# EAGLE design NovaSMTPracticeVX (EAGLE 7.3.0)
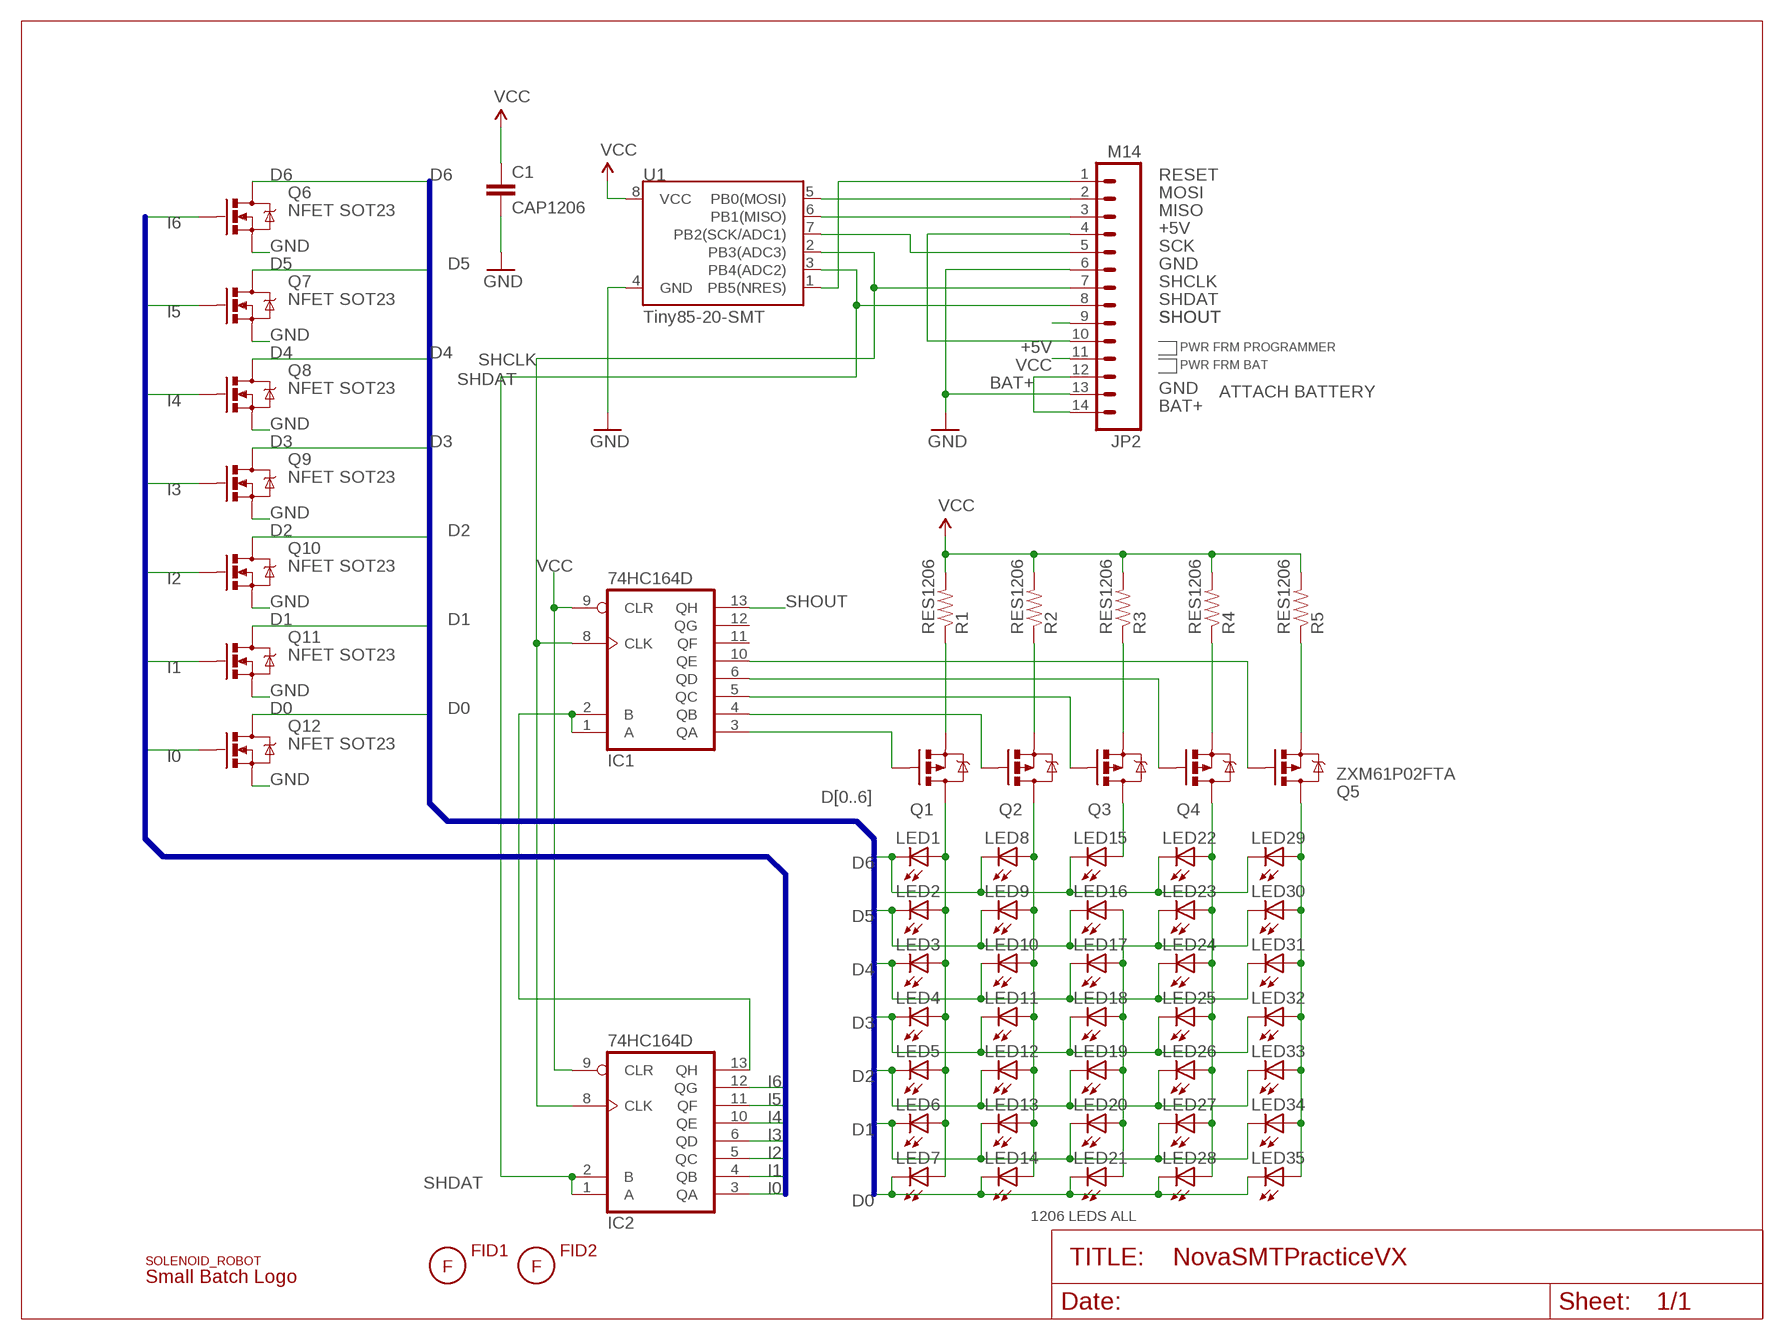
[diagram p0: schematic, sheet 1]

## Parts
C1  CAP1206  [1206]
FID1  FIDUCIAL  [FID05MM]
FID2  FIDUCIAL  [FID05MM]
IC1  74HC164D  [SO14]
IC2  74HC164D  [SO14]
JP2  M14  [1X14_SMTPADS]
LED1  LED1206  [LED-1206]
LED2  LED1206  [LED-1206]
LED3  LED1206  [LED-1206]
LED4  LED1206  [LED-1206]
LED5  LED1206  [LED-1206]
LED6  LED1206  [LED-1206]
LED7  LED1206  [LED-1206]
LED8  LED1206  [LED-1206]
LED9  LED1206  [LED-1206]
LED10  LED1206  [LED-1206]
LED11  LED1206  [LED-1206]
LED12  LED1206  [LED-1206]
LED13  LED1206  [LED-1206]
LED14  LED1206  [LED-1206]
LED15  LED1206  [LED-1206]
LED16  LED1206  [LED-1206]
LED17  LED1206  [LED-1206]
LED18  LED1206  [LED-1206]
LED19  LED1206  [LED-1206]
LED20  LED1206  [LED-1206]
LED21  LED1206  [LED-1206]
LED22  LED1206  [LED-1206]
LED23  LED1206  [LED-1206]
LED24  LED1206  [LED-1206]
LED25  LED1206  [LED-1206]
LED26  LED1206  [LED-1206]
LED27  LED1206  [LED-1206]
LED28  LED1206  [LED-1206]
LED29  LED1206  [LED-1206]
LED30  LED1206  [LED-1206]
LED31  LED1206  [LED-1206]
LED32  LED1206  [LED-1206]
LED33  LED1206  [LED-1206]
LED34  LED1206  [LED-1206]
LED35  LED1206  [LED-1206]
Q1  MOSFET-PCHANNELSMD  [SOT23-3]
Q2  MOSFET-PCHANNELSMD  [SOT23-3]
Q3  MOSFET-PCHANNELSMD  [SOT23-3]
Q4  MOSFET-PCHANNELSMD  [SOT23-3]
Q5  ZXM61P02FTA  MOSFET-PCHANNELSMD  [SOT23-3]
Q6  NFET SOT23  MOSFET-NCHANNELSMD  [SOT23-3]
Q7  NFET SOT23  MOSFET-NCHANNELSMD  [SOT23-3]
Q8  NFET SOT23  MOSFET-NCHANNELSMD  [SOT23-3]
Q9  NFET SOT23  MOSFET-NCHANNELSMD  [SOT23-3]
Q10  NFET SOT23  MOSFET-NCHANNELSMD  [SOT23-3]
Q11  NFET SOT23  MOSFET-NCHANNELSMD  [SOT23-3]
Q12  NFET SOT23  MOSFET-NCHANNELSMD  [SOT23-3]
R1  RES1206  [1206]
R2  RES1206  [1206]
R3  RES1206  [1206]
R4  RES1206  [1206]
R5  RES1206  [1206]
U1  Tiny85-20-SMT  ATTINY45TINY85-20-SMT  [SO08-EIAJ]
U$1  SOLENOID_ROBOT  [SOLENOID_ROBT_450MIL]
U$4  SMALLBATCH_LOGO750W  [SMALLBATCH_750W]

## Nets
+5V: JP2.4 JP2.10
BAT+: JP2.12 JP2.14
D0: LED7.C LED14.C LED21.C LED28.C LED35.C Q12.3(D)
D1: LED6.C LED13.C LED20.C LED27.C LED34.C Q11.3(D)
D2: LED5.C LED12.C LED19.C LED26.C LED33.C Q10.3(D)
D3: LED4.C LED11.C LED18.C LED25.C LED32.C Q9.3(D)
D4: LED3.C LED10.C LED17.C LED24.C LED31.C Q8.3(D)
D5: LED2.C LED9.C LED16.C LED23.C LED30.C Q7.3(D)
D6: LED1.C LED8.C LED15.C LED22.C LED29.C Q6.3(D)
GND: C1.2 JP2.6 JP2.13 Q6.2(S) Q7.2(S) Q8.2(S) Q9.2(S) Q10.2(S) Q11.2(S) Q12.2(S) U1.4(GND)
I0: IC2.3(QA) Q12.1(G)
I1: IC2.4(QB) Q11.1(G)
I2: IC2.5(QC) Q10.1(G)
I3: IC2.6(QD) Q9.1(G)
I4: IC2.10(QE) Q8.1(G)
I5: IC2.11(QF) Q7.1(G)
I6: IC2.12(QG) Q6.1(G)
MISO: JP2.3 U1.6(PB1(MISO))
MOSI: JP2.2 U1.5(PB0(MOSI))
N$1: IC1.1(A) IC1.2(B) IC2.13(QH)
N$8: LED1.A LED2.A LED3.A LED4.A LED5.A LED6.A LED7.A Q1.3(D)
N$9: LED8.A LED9.A LED10.A LED11.A LED12.A LED13.A LED14.A Q2.3(D)
N$10: LED16.A LED17.A LED18.A LED19.A LED20.A LED21.A
N$11: LED22.A LED23.A LED24.A LED25.A LED26.A LED27.A LED28.A Q4.3(D)
N$12: LED29.A LED30.A LED31.A LED32.A LED33.A LED34.A LED35.A Q5.3(D)
N$13: LED15.A Q3.3(D)
N$15: Q1.2(S) R1.1
N$16: Q2.2(S) R2.1
N$18: Q3.2(S) R3.1
N$19: Q4.2(S) R4.1
N$20: Q5.2(S) R5.1
N$21: IC1.3(QA) Q1.1(G)
N$22: IC1.4(QB) Q2.1(G)
N$23: IC1.5(QC) Q3.1(G)
N$24: IC1.6(QD) Q4.1(G)
N$25: IC1.10(QE) Q5.1(G)
RESET: JP2.1 U1.1(PB5(NRES))
SCK: JP2.5 U1.7(PB2(SCK/ADC1))
SHCLK: IC1.8(CLK) IC2.8(CLK) JP2.7 U1.2(PB3(ADC3))
SHDAT: IC2.1(A) IC2.2(B) JP2.8 U1.3(PB4(ADC2))
SHOUT: IC1.13(QH) JP2.9
VCC: C1.1 IC1.9(CLR) IC2.9(CLR) JP2.11 R1.2 R2.2 R3.2 R4.2 R5.2 U1.8(VCC)
Unconnected: IC1.11(QF) IC1.12(QG)

## Buses
D[0..6]
I[0..6]

## Notes on the sheet
- PWR FRM PROGRAMMER
- PWR FRM BAT
- ATTACH BATTERY
- 1206 LEDS ALL

## Power pins joined to a net without a drawn wire
GND: IC1.7(GND) IC2.7(GND)
VCC: IC1.14(VCC) IC2.14(VCC)

## Library data of the parts
C1 = NovaEagleCADCLass:CAP1206
FID1 FID2 = _cogwheel:FIDUCIAL
IC1 IC2 = 74xx-us:74*164: 8-bit parallel out SHIFT REGISTER
JP2 = NovaEagleCADCLass:M14: Header 14 Standard 14-pin 0.1" header. Use with straight break away headers (SKU : PRT-00116), right angle break away headers (PRT-00553), swiss pins (PRT-00743), machine pins (PRT-00117), and female headers (PRT-00115).
LED1-LED35 = NovaEagleCADCLass:LED: LEDs Standard schematic elements and footprints for 5mm, 3mm, 1206, and 0603 sized LEDs. 5mm - Spark Fun Electronics SKU : COM-00529 (and others)
Q1-Q5 = SparkFun-DiscreteSemi:MOSFET-PCHANNEL: Generic PMOSFET
Q6-Q12 = _cogwheel:MOSFET-NCHANNEL
R1-R5 = NovaEagleCADCLass:RES1206
U1 = NovaEagleCADCLass:ATTINY45: Atmel 8-pin 2/4/8kB flash uC; PROD_ID: IC-09092
U$1 = _cogwheel:SOLENOID_ROBOT
U$4 = _cogwheel:SMALLBATCH_LOGO

## Net classes
0 default: width 0.178 mm

## Board
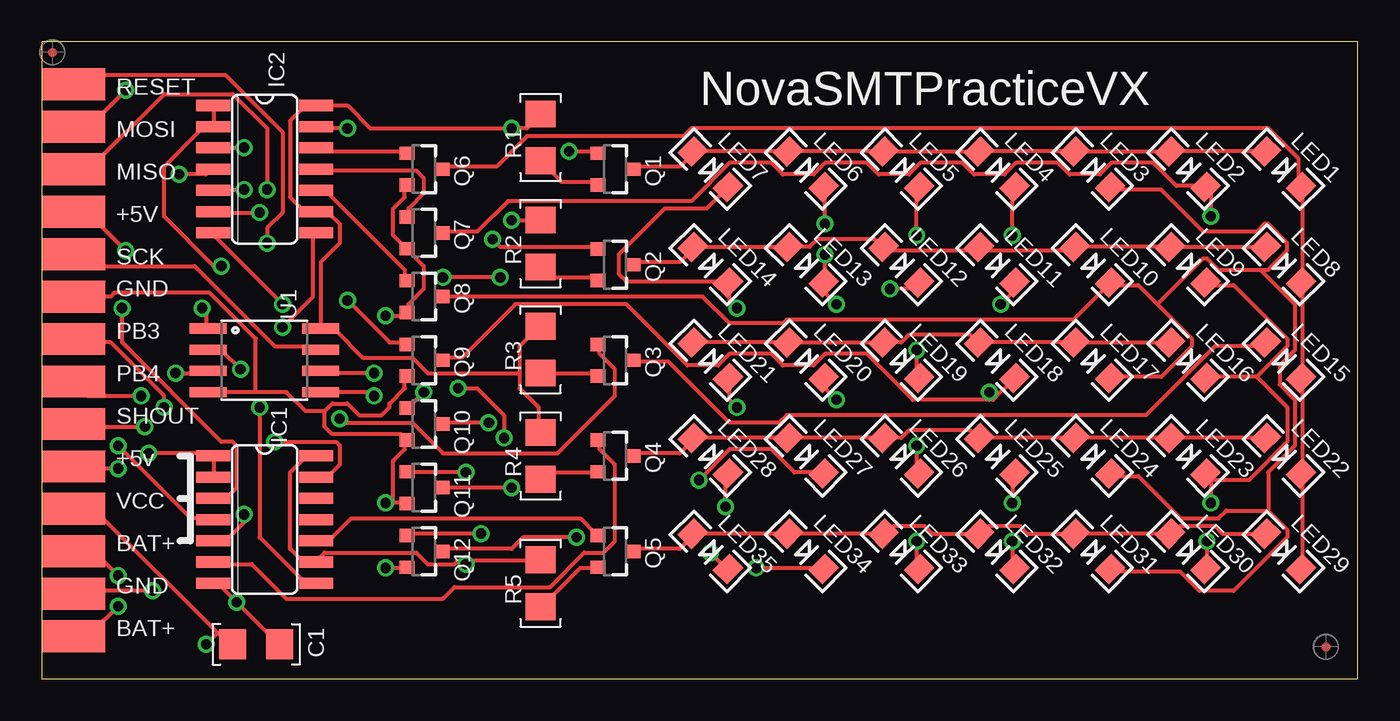
[diagram p1: board, top side]
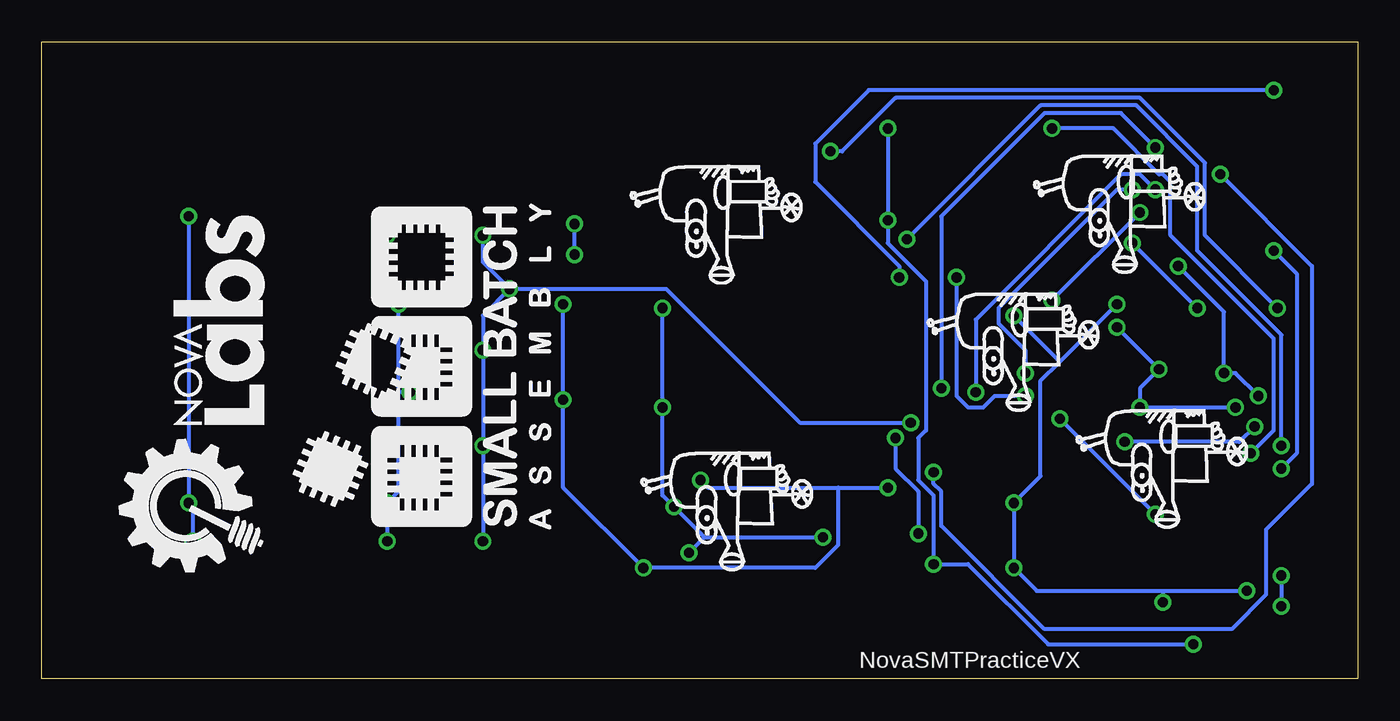
[diagram p2: board, bottom side, seen from below]

Size 78.74 x 38.1 mm. Coordinates in mm from the lower left corner, seen from the top.
Outline: 78.74,38.1 0,38.1 0,0 78.74,0 78.74,38.1
Copper layers (1*16): Top 0.035mm / dielectric 1.5mm / Bottom 0.035mm
Design rules "default *": minimum track width 10mil, minimum drill 24mil, track to track 8mil, track to pad 8mil, pad to pad 8mil, via to via 8mil, smd to smd 8mil, copper to edge 40mil, drill to drill 8mil, minimum pad ring 10mil, minimum via ring 8mil, stop-mask expansion 4mil, vias tented up to drill 27mil, thermal gap 10mil

### Footprints (pad centres in the part's own frame; a part is rotated, then mirrored left to right if it is on the bottom)
1206 = smd 1.6 x 1.8: 1 -1.4,0; 2 1.4,0
SO14 = smd 0.66 x 2.032: 1 -3.81,-3.073; 2 -2.54,-3.073; 3 -1.27,-3.073; 4 0,-3.073; 5 1.27,-3.073; 6 2.54,-3.073; 7 3.81,-3.073; 8 3.81,3.073; 9 2.54,3.073; 10 1.27,3.073; 11 0,3.073; 12 -1.27,3.073; 13 -2.54,3.073; 14 -3.81,3.073
1X14_SMTPADS = smd 1.905 x 3.81: 1 0,0; 2 2.54,0; 3 5.08,0; 4 7.62,0; 5 10.16,0; 6 12.7,0; 7 15.24,0; 8 17.78,0; 9 20.32,0; 10 22.86,0; 11 25.4,0; 12 27.94,0; 13 30.48,0; 14 33.02,0
LED-1206 = smd 1.2 x 1.4: A -1.5,0; C 1.5,0
SOT23-3 = smd 0.8 x 0.9: 1 -0.95,-1; 2 0.95,-1; 3 0,1.1
SO08-EIAJ = smd 0.61 x 2.21: 1 -1.905,-3.378; 2 -0.635,-3.378; 3 0.635,-3.378; 4 1.905,-3.378; 5 1.905,3.353; 6 0.635,3.353; 7 -0.635,3.353; 8 -1.905,3.353

### Placement (x,y rotation side)
C1  12.83,2.06 0 top
FID1  0.64,37.46 270 top
FID2  76.84,1.9 270 top
IC1  13.34,9.53 270 top
IC2  13.34,30.48 270 top
JP2  1.9,35.56 270 top
LED1  74.3,30.48 315 top
LED2  68.58,30.48 315 top
LED3  62.87,30.48 315 top
LED4  57.15,30.48 315 top
LED5  51.43,30.48 315 top
LED6  45.72,30.48 315 top
LED7  40,30.48 315 top
LED8  74.3,24.77 315 top
LED9  68.58,24.77 315 top
LED10  62.87,24.77 315 top
LED11  57.15,24.77 315 top
LED12  51.43,24.77 315 top
LED13  45.72,24.77 315 top
LED14  40,24.77 315 top
LED15  74.3,19.05 315 top
LED16  68.58,19.05 315 top
LED17  62.87,19.05 315 top
LED18  57.15,19.05 315 top
LED19  51.43,19.05 315 top
LED20  45.72,19.05 315 top
LED21  40,19.05 315 top
LED22  74.3,13.34 315 top
LED23  68.58,13.34 315 top
LED24  62.87,13.34 315 top
LED25  57.15,13.34 315 top
LED26  51.43,13.34 315 top
LED27  45.72,13.34 315 top
LED28  40,13.34 315 top
LED29  74.3,7.62 315 top
LED30  68.58,7.62 315 top
LED31  62.87,7.62 315 top
LED32  57.15,7.62 315 top
LED33  51.43,7.62 315 top
LED34  45.72,7.62 315 top
LED35  40,7.62 315 top
Q1  34.29,30.48 270 top
Q2  34.29,24.77 270 top
Q3  34.29,19.05 270 top
Q4  34.29,13.34 270 top
Q5  34.29,7.62 270 top
Q6  22.86,30.48 270 top
Q7  22.86,26.67 270 top
Q8  22.86,22.86 270 top
Q9  22.86,19.05 270 top
Q10  22.86,15.24 270 top
Q11  22.86,11.43 270 top
Q12  22.86,7.62 270 top
R1  29.84,32.38 90 top
R2  29.84,26.04 90 top
R3  29.84,19.68 90 top
R4  29.84,13.34 90 top
R5  29.84,5.71 90 top
U1  13.34,19.05 270 top
U$1  33.02,23.5 90 bottom
U$2  [NOVA-LABS-LOGO-FULL-SMALL]  65.41,6.35 90 bottom
U$3  SOLENOID_ROBOT  [SOLENOID_ROBT_450MIL]  15.24,15.88 90 bottom
U$4  48.26,8.89 90 bottom
U$5  SOLENOID_ROBOT  [SOLENOID_ROBT_450MIL]  8.89,24.13 90 bottom
U$6  SOLENOID_ROBOT  [SOLENOID_ROBT_450MIL]  6.35,8.89 90 bottom
U$7  SOLENOID_ROBOT  [SOLENOID_ROBT_450MIL]  32.38,6.35 90 bottom

### Tracks (layer width: path | path; a pad name or v marks a point on that pad's centre or on a via)
+5V  (via drill 0.61)
  Top 0.254: v4.57,12.57 2.06,12.57 JP2.10 | v5.03,25.6 2.74,27.89 2.06,27.89 JP2.4
  Bottom 0.254: v4.57,12.57 3.66,13.49 3.66,24.23 v5.03,25.6
BAT+  (via drill 0.61)
  Top 0.254: v4.57,4.34 2.97,2.74 2.06,2.74 JP2.14 | v4.57,6.17 3.2,7.54 2.06,7.54 JP2.12
  Bottom 0.254: v4.57,6.17 v4.57,4.34
D0  (via drill 0.61)
  Top 0.254: LED7.C 40.92,29.26 39.78,28.12 37.26,28.12 34.52,25.38 34.52,24.23 34.98,23.77 40.92,23.77 LED14.C 41.15,23.55 41.15,22.63 v41.6,22.17 | v32,8.46 28.8,8.46 28.12,7.77 24,7.77 Q12.3 | v40,7.54 40.92,6.63 LED35.C | v40.92,10.29 40.92,12.12 LED28.C | v41.6,16.23 41.15,16.69 41.15,17.83 LED21.C
  Bottom 0.254: 39.09,8.46 v32,8.46 | v40,7.54 39.09,8.46 | 39.09,8.46 v40.92,10.29 41.6,10.97 v41.6,16.23 v41.6,22.17
D1  (via drill 0.61)
  Top 0.254: v28.12,11.43 Q11.3 | v39.32,11.89 41.15,13.72 43.66,13.72 45.03,12.34 46.63,12.34 LED27.C | v42.75,6.63 46.63,6.63 LED34.C | v47.55,16.69 46.86,17.37 46.86,17.83 LED20.C | v47.55,22.4 46.86,23.09 46.86,23.55 LED13.C 46.86,23.77 v46.86,25.38 | v46.86,27.2 46.86,29.26 LED6.C
  Bottom 0.254: 31.09,11.43 38.86,11.43 v39.32,11.89 | 31.09,11.43 v28.12,11.43 | 31.09,11.43 31.09,8 32.46,6.63 v42.75,6.63 47.55,11.43 v47.55,16.69 v47.55,22.4 | v46.86,25.38 v46.86,27.2
D2  (via drill 0.61)
  Top 0.254: v26.75,15.32 24,15.32 Q10.3 | v50.75,23.32 52.12,23.32 52.35,23.55 LED12.C | v52.35,8.23 52.35,6.63 LED33.C | v52.35,13.95 52.35,12.34 LED26.C | v52.35,19.66 52.35,18.06 LED19.C | v52.35,26.52 52.35,29.26 LED5.C
  Bottom 0.254: v26.75,15.32 33.38,15.32 41.38,23.32 v50.75,23.32 | v52.35,8.23 v52.35,13.95 v52.35,19.66 52.35,21.72 v50.75,23.32 | v52.35,26.52 52.35,24.92 v50.75,23.32
D3  (via drill 0.61)
  Top 0.254: v58.06,8.23 58.06,6.63 LED32.C | v58.06,10.52 58.06,12.12 LED25.C | v57.38,22.4 58.06,23.09 58.06,23.55 LED11.C | v58.06,26.52 58.06,29.26 LED4.C | 56.69,16.69 56.92,16.69 58.06,17.83 LED18.C | 56.69,16.69 52.12,16.69 49.38,19.43 46.86,19.43 46.18,18.75 44.35,18.75 43.66,19.43 41.15,19.43 40.46,18.75 38.63,18.75 34.98,22.4 28.35,22.4 25.15,19.2 24,19.2 Q9.3 | 56.69,16.69 v56.69,17.14
  Bottom 0.254: v58.06,8.23 v58.06,10.52 57.38,11.2 57.38,17.14 | 57.38,17.14 v57.38,22.4 58.06,23.09 v58.06,26.52 | v56.69,17.14 57.38,17.14
D4
  Top 0.254: 73.38,10.06 74.52,8.92 74.52,8.46 71.32,5.26 69.27,5.26 68.12,6.4 64.01,6.4 LED31.C | 73.38,10.06 70.87,10.06 70.41,9.6 68.12,9.6 65.61,12.12 64.01,12.12 LED24.C | Q8.3 39.55,22.86 41.15,21.26 44.35,21.26 44.58,21.49 61.72,21.49 63.78,23.55 LED10.C 64.01,23.55 65.61,23.55 66.75,22.4 | 66.75,22.4 68.81,20.34 68.81,19.89 66.98,18.06 64.01,18.06 LED17.C | 72.92,24.46 70.41,24.46 69.72,25.15 69.49,25.15 66.75,22.4 | 72.92,24.46 73.38,24.46 74.52,25.6 74.52,26.06 73.38,27.2 73.15,27.2 72.7,26.75 69.49,26.75 66.98,29.26 64.01,29.26 LED3.C | 73.38,10.06 73.38,12.34 74.98,13.95 74.98,16.69 74.07,17.6 74.07,18.75 74.98,19.66 74.98,22.4 72.92,24.46
D5  (via drill 0.61)
  Top 0.254: v69.72,8.23 69.72,6.63 LED30.C | 69.95,11.89 v69.95,10.52 | 69.95,11.89 69.72,12.12 LED23.C 69.95,11.89 | 72.7,18.06 69.72,18.06 LED16.C | 72.7,18.06 74.52,19.89 74.52,20.34 71.32,23.55 69.72,23.55 LED9.C | 69.95,11.89 72.24,11.89 74.52,14.17 74.52,16.23 72.7,18.06 | Q7.3 24,26.75 26.06,26.75 27.89,28.57 38.86,28.57 41.15,30.86 43.66,30.86 44.35,30.18 46.18,30.18 46.86,30.86 49.38,30.86 50.06,30.18 51.89,30.18 52.58,30.86 55.09,30.86 55.78,30.18 57.61,30.18 58.29,30.86 60.81,30.86 61.49,30.18 63.32,30.18 64.01,30.86 66.52,30.86 67.89,29.49 69.49,29.49 LED2.C 69.72,29.26 69.95,29.03 v69.95,27.66
  Bottom 0.254: v69.72,8.23 69.72,10.29 v69.95,10.52 v69.95,27.66
D6
  Top 0.254: LED29.C 75.44,6.63 75.44,12.12 LED22.C 75.44,12.34 75.44,17.83 LED15.C 75.44,18.06 75.44,23.55 LED8.C 75.44,23.77 75.44,29.26 LED1.C 75.21,29.49 75.21,31.09 73.38,32.92 38.86,32.92 38.4,32.46 29.03,32.46 27.2,30.63 24,30.63 Q6.3
GND  (via drill 0.61)
  Top 0.254: IC1.7 10.52,5.71 v11.66,4.57 14.17,2.06 C1.2 | Q6.2 21.72,29.49 21.72,28.8 21.03,28.12 21.03,26.52 21.72,25.83 Q7.2 21.95,25.6 22.86,24.69 22.86,23.32 21.95,22.4 21.95,21.95 Q8.2 21.72,21.72 v20.57,21.72 | v20.57,6.63 21.72,6.63 Q12.2 | 21.03,10.52 21.72,10.52 Q11.2 | 21.03,10.52 21.03,13.03 21.72,13.72 21.72,14.17 Q10.2 21.72,14.4 21.49,14.63 17.37,14.63 16.92,15.09 16.92,16 | 21.03,10.52 v20.57,10.52 | 16.92,16 17.37,16.46 18.29,16.46 18.97,15.77 20.34,15.77 20.8,16.23 20.8,16.46 21.72,17.37 21.72,18.06 Q9.2 | v14.4,22.4 10.29,26.52 IC2.7 | 12.8,17.14 14.63,17.14 15.77,16 16.92,16 | 12.8,17.14 U1.4 | v6.63,5.26 2.06,5.26 JP2.13 | JP2.6 4.12,22.86 4.34,23.09 10.06,23.09 12.8,20.34 12.8,17.14
  Bottom 0.254: 17.83,18.97 18.97,17.83 18.97,12.12 v20.57,10.52 v20.57,6.63 19.2,5.26 11.66,5.26 | 17.83,18.97 v14.4,22.4 | 17.83,18.97 v20.57,21.72 | 11.66,5.26 v6.63,5.26 | 11.66,5.26 v11.66,4.57
I0  (via drill 0.61)
  Top 0.254: v26.29,8.69 21.95,8.69 Q12.1 | v27.66,14.4 27.66,15.77 26.06,17.37 v24.92,17.37 | v12.12,31.78 10.29,31.78 IC2.3
  Bottom 0.254: v26.29,8.69 26.29,11.2 27.66,12.57 v27.66,14.4 | v24.92,17.37 24.92,27.66 18.75,33.83 14.17,33.83 v12.12,31.78
I1  (via drill 0.61)
  Top 0.254: v25.38,12.34 21.95,12.34 Q11.1 | v8.23,30.18 9.83,30.18 10.06,30.4 IC2.4
  Bottom 0.254: v25.38,12.34 25.38,11.66 24.92,11.2 24.92,9.14 18.75,2.97 7.54,2.97 5.49,5.03 5.49,8.92 2.74,11.66 2.74,24.69 v8.23,30.18
I2  (via drill 0.61)
  Top 0.254: v22.86,17.14 21.95,16.23 Q10.1 | v12.12,29.26 10.29,29.26 IC2.5
  Bottom 0.254: v22.86,17.14 22.86,21.49 14.17,30.18 13.03,30.18 v12.12,29.26
I3  (via drill 0.61)
  Top 0.254: v18.29,22.63 20.8,20.12 21.72,20.12 Q9.1 | v13.03,27.89 10.29,27.89 IC2.6
  Bottom 0.254: v13.03,27.89 v18.29,22.63
I4
  Top 0.254: Q8.1 21.72,24 21.72,24.46 17.14,29.03 16.46,29.03 IC2.10
I5
  Top 0.254: Q7.1 21.95,27.66 21.95,28.12 22.86,29.03 22.86,29.95 22.4,30.4 16.46,30.4 IC2.11
I6
  Top 0.254: Q6.1 21.72,31.55 16.46,31.55 IC2.12
MISO  (via drill 0.61)
  Top 0.254: v19.89,18.29 16.69,18.29 U1.6 | v13.49,29.26 13.49,32.92 11.43,34.98 7.32,34.98 2.97,30.63 2.06,30.63 JP2.3
  Bottom 0.254: v19.89,18.29 19.89,19.66 21.49,21.26 21.49,22.17 14.4,29.26 v13.49,29.26
MOSI  (via drill 0.61)
  Top 0.254: U1.5 19.66,17.14 v19.89,16.92 | v27.43,24 v24,24 | v5.03,35.2 2.97,33.15 2.06,33.15 JP2.2
  Bottom 0.254: v19.89,16.92 21.72,16.92 22.4,16.23 23.32,16.23 24,16.92 v24,24 | v27.43,24 27.43,24.69 32.46,29.72 32.46,32 29.26,35.2 v5.03,35.2
N$1  (via drill 0.61)
  Top 0.254: IC1.2 10.29,12.12 10.29,13.26 IC1.1 10.06,13.49 v6.4,13.49 | v18.29,32.92 16.46,32.92 IC2.13
  Bottom 0.254: v18.29,32.92 14.63,32.92 11.89,30.18 11.66,30.18 11.2,29.72 11.2,26.52 5.03,20.34 5.03,14.86 v6.4,13.49
N$8
  Top 0.254: LED1.A 73.15,31.55 67.67,31.55 LED2.A 67.44,31.55 61.95,31.55 LED3.A 61.72,31.55 56.24,31.55 LED4.A 56.01,31.55 50.52,31.55 LED5.A 50.29,31.55 44.81,31.55 LED6.A 44.58,31.55 39.09,31.55 LED7.A 38.86,31.32 38.18,30.63 35.43,30.63 Q1.3
N$9
  Top 0.254: Q2.3 35.43,24.92 38.18,24.92 38.86,25.6 LED14.A 39.09,25.83 44.58,25.83 LED13.A 44.81,25.83 45.95,25.83 46.41,26.29 49.83,26.29 50.29,25.83 LED12.A 50.52,25.6 56.01,25.6 LED11.A 56.24,25.6 61.72,25.6 LED10.A 61.95,25.83 67.44,25.83 LED9.A 67.67,25.83 73.15,25.83 LED8.A
N$10
  Top 0.254: LED21.A 39.09,20.12 44.58,20.12 LED20.A 44.81,20.12 50.29,20.12 LED19.A 50.52,20.12 51.43,20.12 51.89,20.57 55.55,20.57 56.01,20.12 LED18.A 56.24,20.12 61.72,20.12 LED17.A 61.95,20.12 67.44,20.12 LED16.A
N$11
  Top 0.254: Q4.3 35.43,13.49 38.18,13.49 38.86,14.17 LED28.A 39.09,14.4 44.58,14.4 LED27.A 44.81,14.4 50.29,14.4 LED26.A 50.52,14.4 51.43,14.4 51.89,14.86 55.55,14.86 56.01,14.4 LED25.A 56.24,14.4 61.72,14.4 LED24.A 61.95,14.4 67.44,14.4 LED23.A 67.67,14.4 73.15,14.4 LED22.A
N$12
  Top 0.254: LED29.A 73.15,8.69 70.64,8.69 70.18,9.14 68.12,9.14 67.67,8.69 LED30.A 67.44,8.69 61.95,8.69 LED31.A 61.72,8.69 58.98,8.69 58.52,9.14 56.69,9.14 56.24,8.69 LED32.A 56.01,8.69 53.26,8.69 52.81,9.14 50.98,9.14 50.52,8.69 LED33.A 50.29,8.69 44.81,8.69 LED34.A 44.58,8.69 39.09,8.69 LED35.A 38.86,8.46 38.18,7.77 35.43,7.77 Q5.3
N$13
  Top 0.254: Q3.3 35.43,18.97 37.49,18.97 41.15,15.32 44.12,15.32 44.58,15.77 66.06,15.77 70.18,19.89 73.15,19.89 LED15.A
N$15
  Top 0.254: Q1.2 33.15,29.72 31.09,29.72 29.95,30.86 R1.1
N$16
  Top 0.254: Q2.2 33.15,24 30.4,24 29.95,24.46 R2.1
N$18
  Top 0.254: Q3.2 33.15,18.29 29.95,18.29 R3.1
N$19
  Top 0.254: Q4.2 33.15,12.34 30.18,12.34 29.95,12.12 R4.1
N$20
  Top 0.254: Q5.2 33.15,6.63 32.23,6.63 29.95,4.34 R5.1
N$21  (via drill 0.61)
  Top 0.254: v31.55,31.55 33.15,31.55 Q1.1 | v4.8,22.17 4.8,20.12 10.74,14.17 11.43,14.17 11.66,13.95 11.66,11.43 11.2,10.97 10.29,10.97 IC1.3
  Bottom 0.254: v31.55,31.55 30.86,31.55 27.66,34.75 13.03,34.75 9.14,30.86 9.14,26.52 v4.8,22.17
N$22  (via drill 0.61)
  Top 0.254: v26.98,26.29 27.43,25.83 33.15,25.83 Q2.1 | v4.57,13.95 8.92,9.6 10.06,9.6 IC1.4
  Bottom 0.254: v26.98,26.29 18.97,34.29 13.26,34.29 9.6,30.63 9.6,25.6 4.57,20.57 v4.57,13.95
N$23  (via drill 0.61)
  Top 0.254: v17.83,15.55 18.06,15.32 22.17,15.32 24,13.49 30.86,13.49 34.29,16.92 34.29,18.52 33.38,19.43 33.38,19.89 Q3.1 | v12.12,9.83 12.12,9.37 11.2,8.46 10.29,8.46 IC1.5
  Bottom 0.254: v12.12,9.83 v17.83,15.55
N$24
  Top 0.254: Q4.1 33.38,14.17 33.38,13.72 34.29,12.8 34.29,8.23 33.6,7.54 32.46,7.54 30.4,5.49 24.69,5.49 24,4.8 14.63,4.8 12.57,6.86 10.29,6.86 IC1.6
N$25
  Top 0.254: Q5.1 33.15,8.69 32.23,9.6 18.52,9.6 17.37,8.46 16.46,8.46 IC1.10
RESET  (via drill 0.61)
  Top 0.254: v9.6,22.17 9.83,21.95 9.83,21.03 U1.1 | v13.49,26.06 13.49,26.98 14.4,27.89 14.4,32.69 10.97,36.12 2.52,36.12 2.06,35.66 JP2.1
  Bottom 0.254: v13.49,26.06 v9.6,22.17
SCK
  Top 0.254: U1.7 16.69,19.89 13.95,19.89 9.14,24.69 2.74,24.69 2.06,25.38 JP2.5
SHCLK  (via drill 0.61)
  Top 0.254: IC1.8 15.77,5.71 13.03,8.46 v13.03,16.23 | v11.89,18.52 10.74,19.66 10.06,19.66 U1.2 | v14.4,21.03 16.23,22.86 16.23,26.52 IC2.8 | v7.32,16.23 7.32,16.92 4.12,20.12 2.06,20.12 JP2.7
  Bottom 0.254: v14.4,21.03 v11.89,18.52 13.03,17.37 v13.03,16.23 v7.32,16.23
SHDAT  (via drill 0.61)
  Top 0.254: IC2.1 10.29,34.29 10.29,33.15 IC2.2 10.06,32.92 9.6,32.92 7.32,30.63 7.32,27.66 10.29,24.69 v10.74,24.69 | v8,18.29 9.83,18.29 U1.3 | v5.94,16.92 2.74,16.92 2.06,17.6 JP2.8
  Bottom 0.254: v5.94,16.92 7.32,18.29 v8,18.29 8,21.95 v10.74,24.69
SHOUT  (via drill 0.61)
  Top 0.254: v13.95,14.17 17.6,14.17 17.83,13.95 17.83,12.8 17.14,12.12 16.46,12.12 IC1.13 | v6.17,15.09 2.06,15.09 JP2.9
  Bottom 0.254: v13.95,14.17 7.09,14.17 v6.17,15.09
VCC  (via drill 0.61)
  Top 0.254: 10.52,2.74 3.2,10.06 2.06,10.06 JP2.11 | 10.52,2.74 11.2,2.06 C1.1 | 25.38,7.09 24.92,7.09 24.69,6.86 23.09,6.86 22.4,7.54 16.92,7.54 16.46,7.09 IC1.9 16.23,7.09 15.55,7.09 14.86,7.77 14.86,12.34 15.77,13.26 16.23,13.26 IC1.14 | 25.38,7.09 29.72,7.09 R5.2 | v28.12,27.43 29.72,27.43 R2.2 | R1.2 29.72,33.6 29.03,32.92 v28.12,32.92 19.66,32.92 18.29,34.29 IC2.14 15.77,34.29 14.86,33.38 14.86,28.8 15.55,28.12 16.23,28.12 IC2.9 16.46,27.89 17.14,27.89 17.83,27.2 17.83,26.06 16.69,24.92 U1.8 16.69,20.8 17.6,20.8 19.2,19.2 22.17,19.2 23.09,18.29 28.57,18.29 | 28.57,18.29 28.57,19.89 29.72,21.03 R3.2 | 28.57,18.29 28.57,17.37 29.72,16.23 29.72,14.86 R4.2 | v25.38,6.86 25.38,7.09 | v9.83,2.06 10.52,2.74
  Bottom 0.254: v28.12,32.92 v28.12,27.43 28.12,26.06 25.83,23.77 25.83,14.86 26.29,14.4 26.29,11.89 25.38,10.97 v25.38,6.86 23.32,6.86 18.52,2.06 v9.83,2.06

### Text on the board
tNames: RESET | MOSI | MISO | +5V | SCK | GND | PB3 | PB4 | SHOUT | +5v | VCC | BAT+ | GND | BAT+